# Altium schematic sheet OPs.SchDoc
size A4
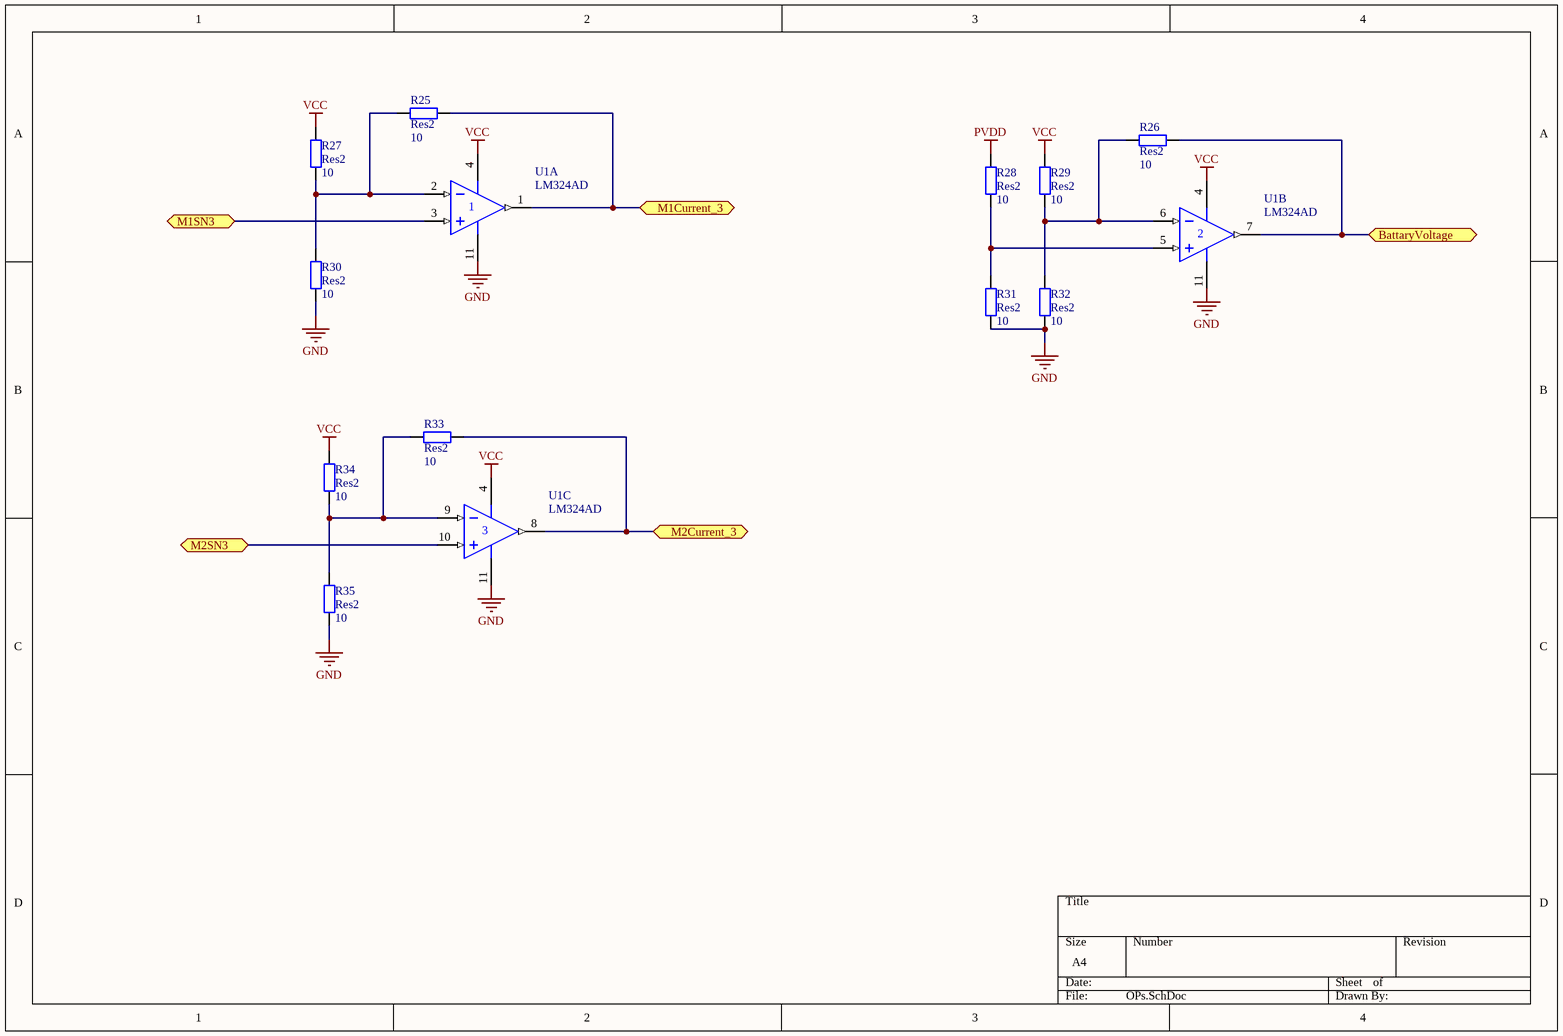
[diagram p0: OPs.SchDoc]

## Parts
R25  Res2  value 10  [6-0805_N]
R26  Res2  value 10  [6-0805_N]
R27  Res2  value 10  [6-0805_N]
R28  Res2  value 10  [6-0805_N]
R29  Res2  value 10  [6-0805_N]
R30  Res2  value 10  [6-0805_N]
R31  Res2  value 10  [6-0805_N]
R32  Res2  value 10  [6-0805_N]
R33  Res2  value 10  [6-0805_N]
R34  Res2  value 10  [6-0805_N]
R35  Res2  value 10  [6-0805_N]
U1  LM324AD  [751A-02_N]  (parts A,B,C of 4)

## Ports
BattaryVoltage, M1Current_3, M1SN3, M2Current_3, M2SN3

## Nets
GND: R30.1 R31.1 R32.1 R35.1 U1.11(V-)
PVDD: R28.2
VCC: R27.2 R29.2 R34.2 U1.4(V+)
BattaryVoltage: R26.2 U1.7(OUT) ; port BattaryVoltage
M1Current_3: R25.2 U1.1(OUT) ; port M1Current_3
M1SN3: U1.3(IN+) ; port M1SN3
M2Current_3: R33.2 U1.8(OUT) ; port M2Current_3
M2SN3: U1.10(IN+) ; port M2SN3
NetR25_1: R25.1 R27.1 R30.2 U1.2(IN-)
NetR26_1: R26.1 R29.1 R32.2 U1.6(IN-)
NetR28_1: R28.1 R31.2 U1.5(IN+)
NetR33_1: R33.1 R34.1 R35.2 U1.9(IN-)

## Library data of the parts
R25-R35 = Res2: Resistor; Published: 8-Jun-2000; LatestRevisionDate: 17-Jul-2002; LatestRevisionNote: Re-released for DXP Platform.; PackageReference: AXIAL-0.4; Publisher: Altium Limited; PackageDescription: Axial Device, Thru-Hole; 2 Leads; 0.4 in Pin Spacing
U1 = LM324AD: Quad Low-Power Operational Amplifier; Published: 17-Jul-2002; LatestRevisionDate: 13-Apr-2006; LatestRevisionNote: IPC-7351 Footprint Added.; DatasheetVersion: 1988; PackageVersion: 1991; PackageReference: 751A-02; Publisher: Altium Limited; PackageDescription: 14-Pin Small Outline Integrated Circuit 1.27 mm Pitch; Code_IPC: SOIC127P600-14; ComponentLink1Description: Manufacturer Link; ComponentLink1URL: http://www.onsemi.com/site/products/parametrics/0,4446,251,00.html; ComponentLink2Description: Datasheet; ComponentLink2URL: http://www.onsemi.com/pub/Collateral/LM324-D.PDF